# EasyEDA Pro project Enviroment（revision）.eprj

# Schematic Schematic1
Board Name: Board1; Create Date: 2025-10-28; Page Name: P1; Project Name: Enviroment（revision）; Schematic Name: Schematic1; Update Date: 2025-11-17; Company: EasyEDA.com; Page Size: A4; Version: V1.0
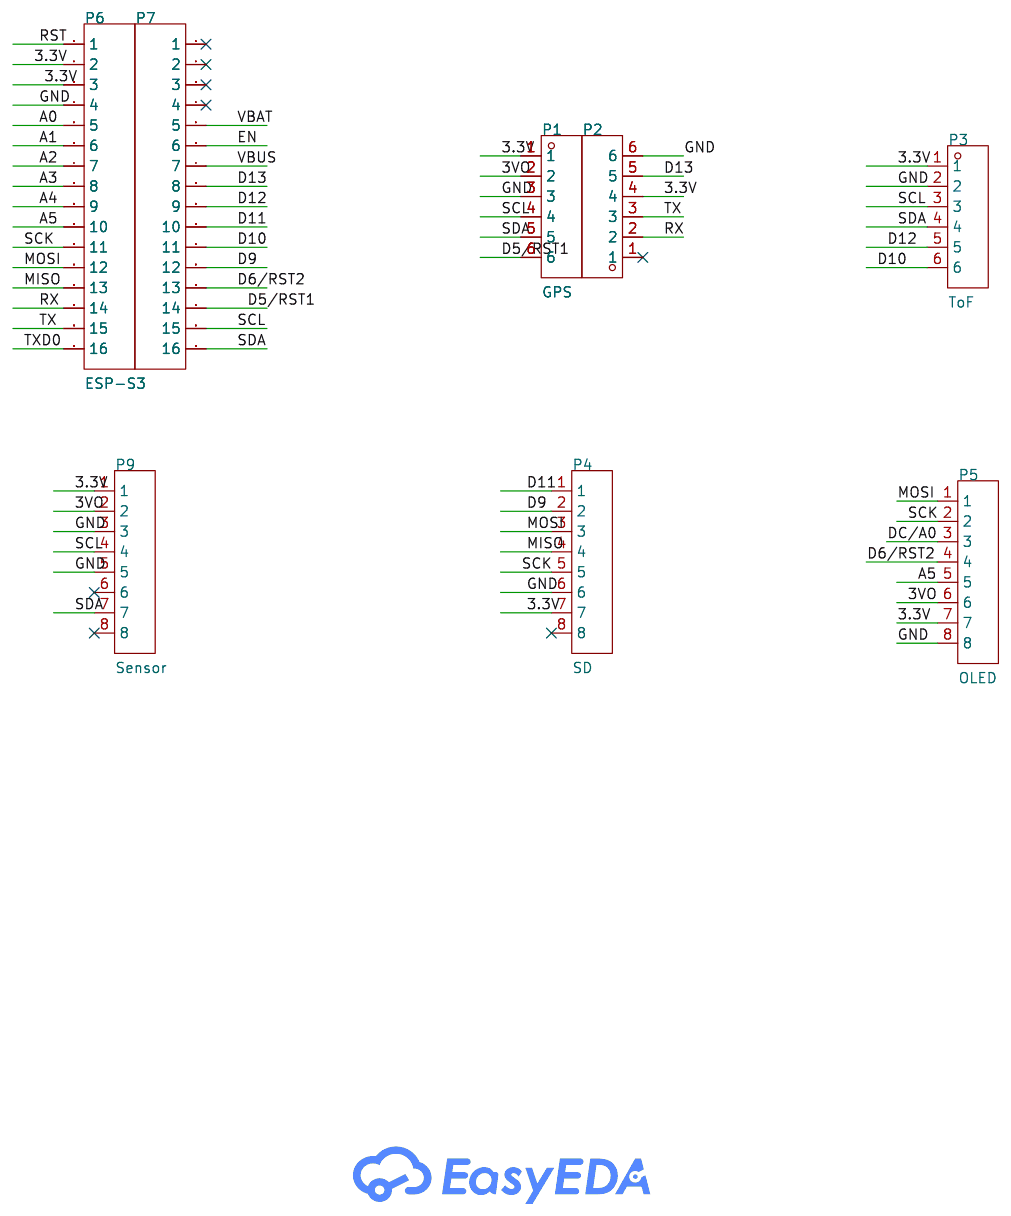
[diagram p0: schematic sheet]

## Parts
P1  GPS  [HDR-TH_6P-P2.54-V-F]
P2  2.54-1*6P母  [HDR-TH_6P-P2.54-V-F]
P3  ToF  [HDR-TH_6P-P2.54-V-F]
P4  SD  [HDR-TH_8P-P2.54-V-F_2]
P5  OLED  [HDR-TH_8P-P2.54-V-F_2]
P6  ESP-S3  [HDR-TH_16P-P2.54-V-F-1]
P7  2.54-1*16P母  [HDR-TH_16P-P2.54-V-F-1]
P9  Sensor  [HDR-TH_8P-P2.54-V-F_2]

## Library data of the parts
P1-P3 = 2.54-1*6P母: Holes Structure:1x6P Pitch:2.54mm Row Spacing:- Circular Hole / Square Hole:Square Hole Mounting Type:Through Hole Number of Rows:1 Number of Positions:6P Current Rating:3A Voltage Rating (Max):- Holes Direction:Top Insulation Height:- Contact Material:-; LCSC Part Name: 1x6P 间距:2.54mm 直插; Supplier Part: C40877; Manufacturer: BOOMELE(博穆精密); Supplier Footprint: 插件,P=2.54mm; JLCPCB Part Class: Extended Part; Datasheet: https://item.szlcsc.com/datasheet/2.54-1*6P%25E6%25AF%258D/41861.html; Supplier: LCSC; Holes Structure: 1x6P; Pitch: 2.54mm; Circular Hole / Square Hole: Square Hole; Mounting Type: Through Hole; Number of Rows: 1; Number of Positions: 6P; Current Rating: 3A; Holes Direction: Top; Operating Temperature: -40℃~+105℃
P4 P5 P9 = 2.54-1*8P母环保: Holes Structure:1x8P Pitch:2.54mm Row Spacing:- Circular Hole / Square Hole:Square Hole Mounting Type:Through Hole Number of Rows:1 Number of Positions:8P Holes Direction:Top Insulation Height:- Contact Material:- Contact Plating:-; LCSC Part Name: 1x8P 间距:2.54mm 直插; Supplier Part: C27438; Manufacturer: BOOMELE(博穆精密); Supplier Footprint: 插件,P=2.54mm; JLCPCB Part Class: 扩展库; Datasheet: https://item.szlcsc.com/datasheet/2.54-1*8P%25E6%25AF%258D%25E7%258E%25AF%25E4%25BF%259D/28187.html; Supplier: LCSC; Holes Structure: 1x8P; Pitch: 2.54mm; Circular Hole / Square Hole: Square Hole; Mounting Type: Through Hole; Number of Rows: 1; Number of Positions: 8P; Holes Direction: Top
P6 P7 = 2.54-1*16P母: Pitch:2.54mm Row Spacing:- Circular Hole / Square Hole:Square Hole Mounting Type:Through Hole Number of Rows:1 Number of Positions:16P Holes Direction:Top Insulation Height:- Contact Material:- Contact Plating:-; LCSC Part Name: 间距:2.54mm 直插; Supplier Part: C66987; Manufacturer: BOOMELE(博穆精密); Supplier Footprint: 插件,P=2.54mm; JLCPCB Part Class: 扩展库; Datasheet: https://item.szlcsc.com/datasheet/2.54-1*16P%25E6%25AF%258D/68075.html; Supplier: LCSC; Pitch: 2.54mm; Circular Hole / Square Hole: Square Hole; Mounting Type: Through Hole; Number of Rows: 1; Number of Positions: 16P; Holes Direction: Top

## Nets
3.3V: P1.1 P2.4 P3.1 P4.7 P5.7 P6.2 P6.3 P9.1
3VO: P1.2 P5.6 P9.2
GND: P1.3 P2.6 P3.2 P4.6 P5.8 P6.4 P9.3 P9.5
VBAT: P7.5
VBUS: P7.7
A0: P6.5
A1: P6.6
A2: P6.7
A3: P6.8
A4: P6.9
A5: P5.5 P6.10
D5/RST1: P1.6 P7.14
D6/RST2: P5.4 P7.13
D9: P4.2 P7.12
D10: P3.6 P7.11
D11: P4.1 P7.10
D12: P3.5 P7.9
D13: P2.5 P7.8
DC/A0: P5.3
EN: P7.6
MISO: P4.4 P6.13
MOSI: P4.3 P5.1 P6.12
RST: P6.1
RX: P2.2 P6.14
SCK: P4.5 P5.2 P6.11
SCL: P1.4 P3.3 P7.15 P9.4
SDA: P1.5 P3.4 P7.16 P9.7
TX: P2.3 P6.15
TXD0: P6.16

Not connected (* = marked no-connect by the designer): P2 1*; P4 8*; P7 1* 2* 3* 4*; P9 6* 8*

# Board PCB1
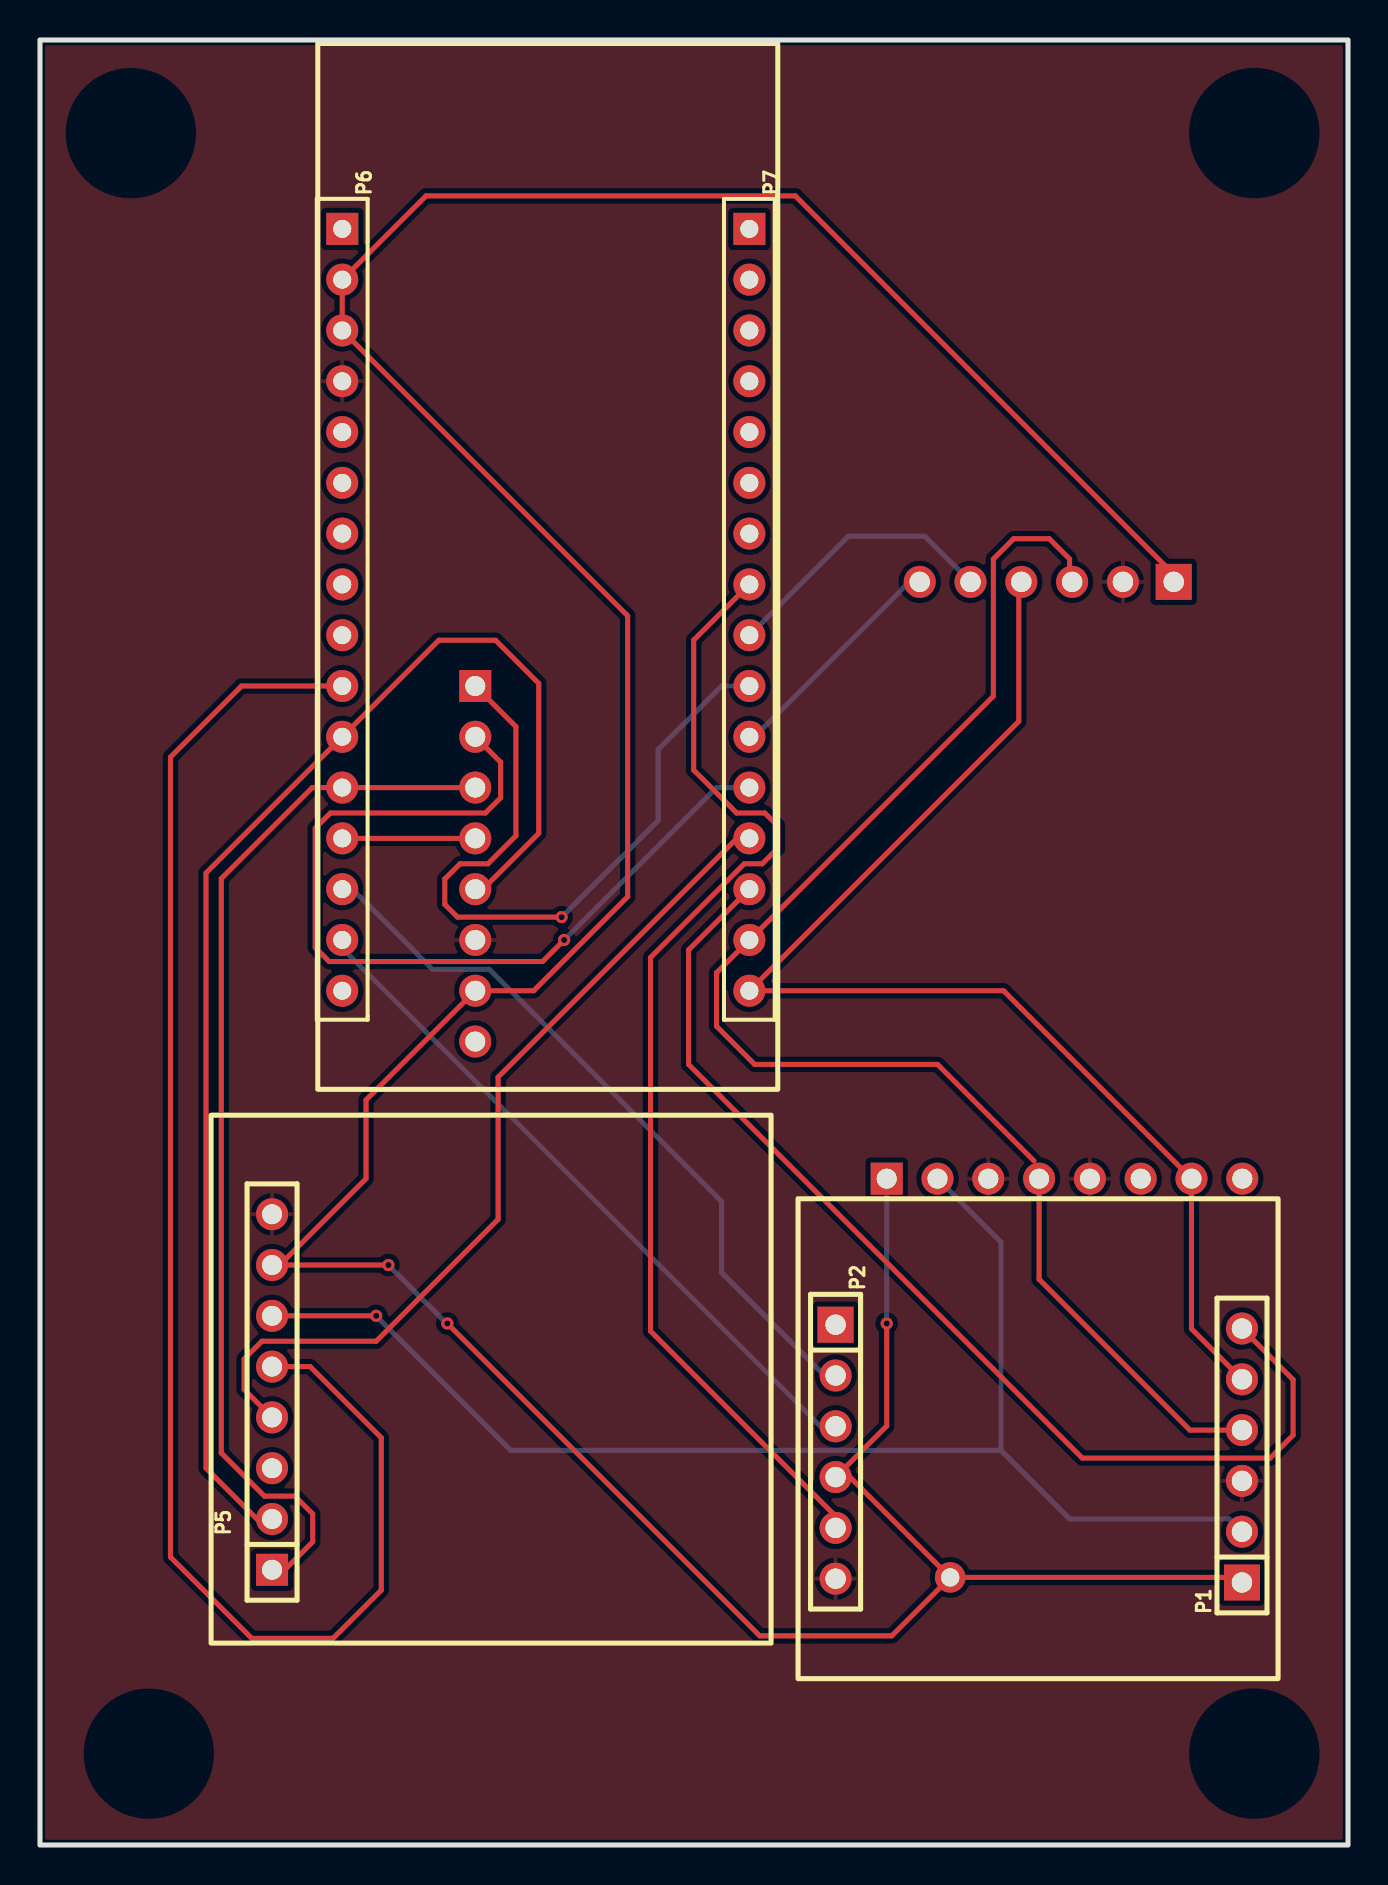
[diagram p1: board, top side]
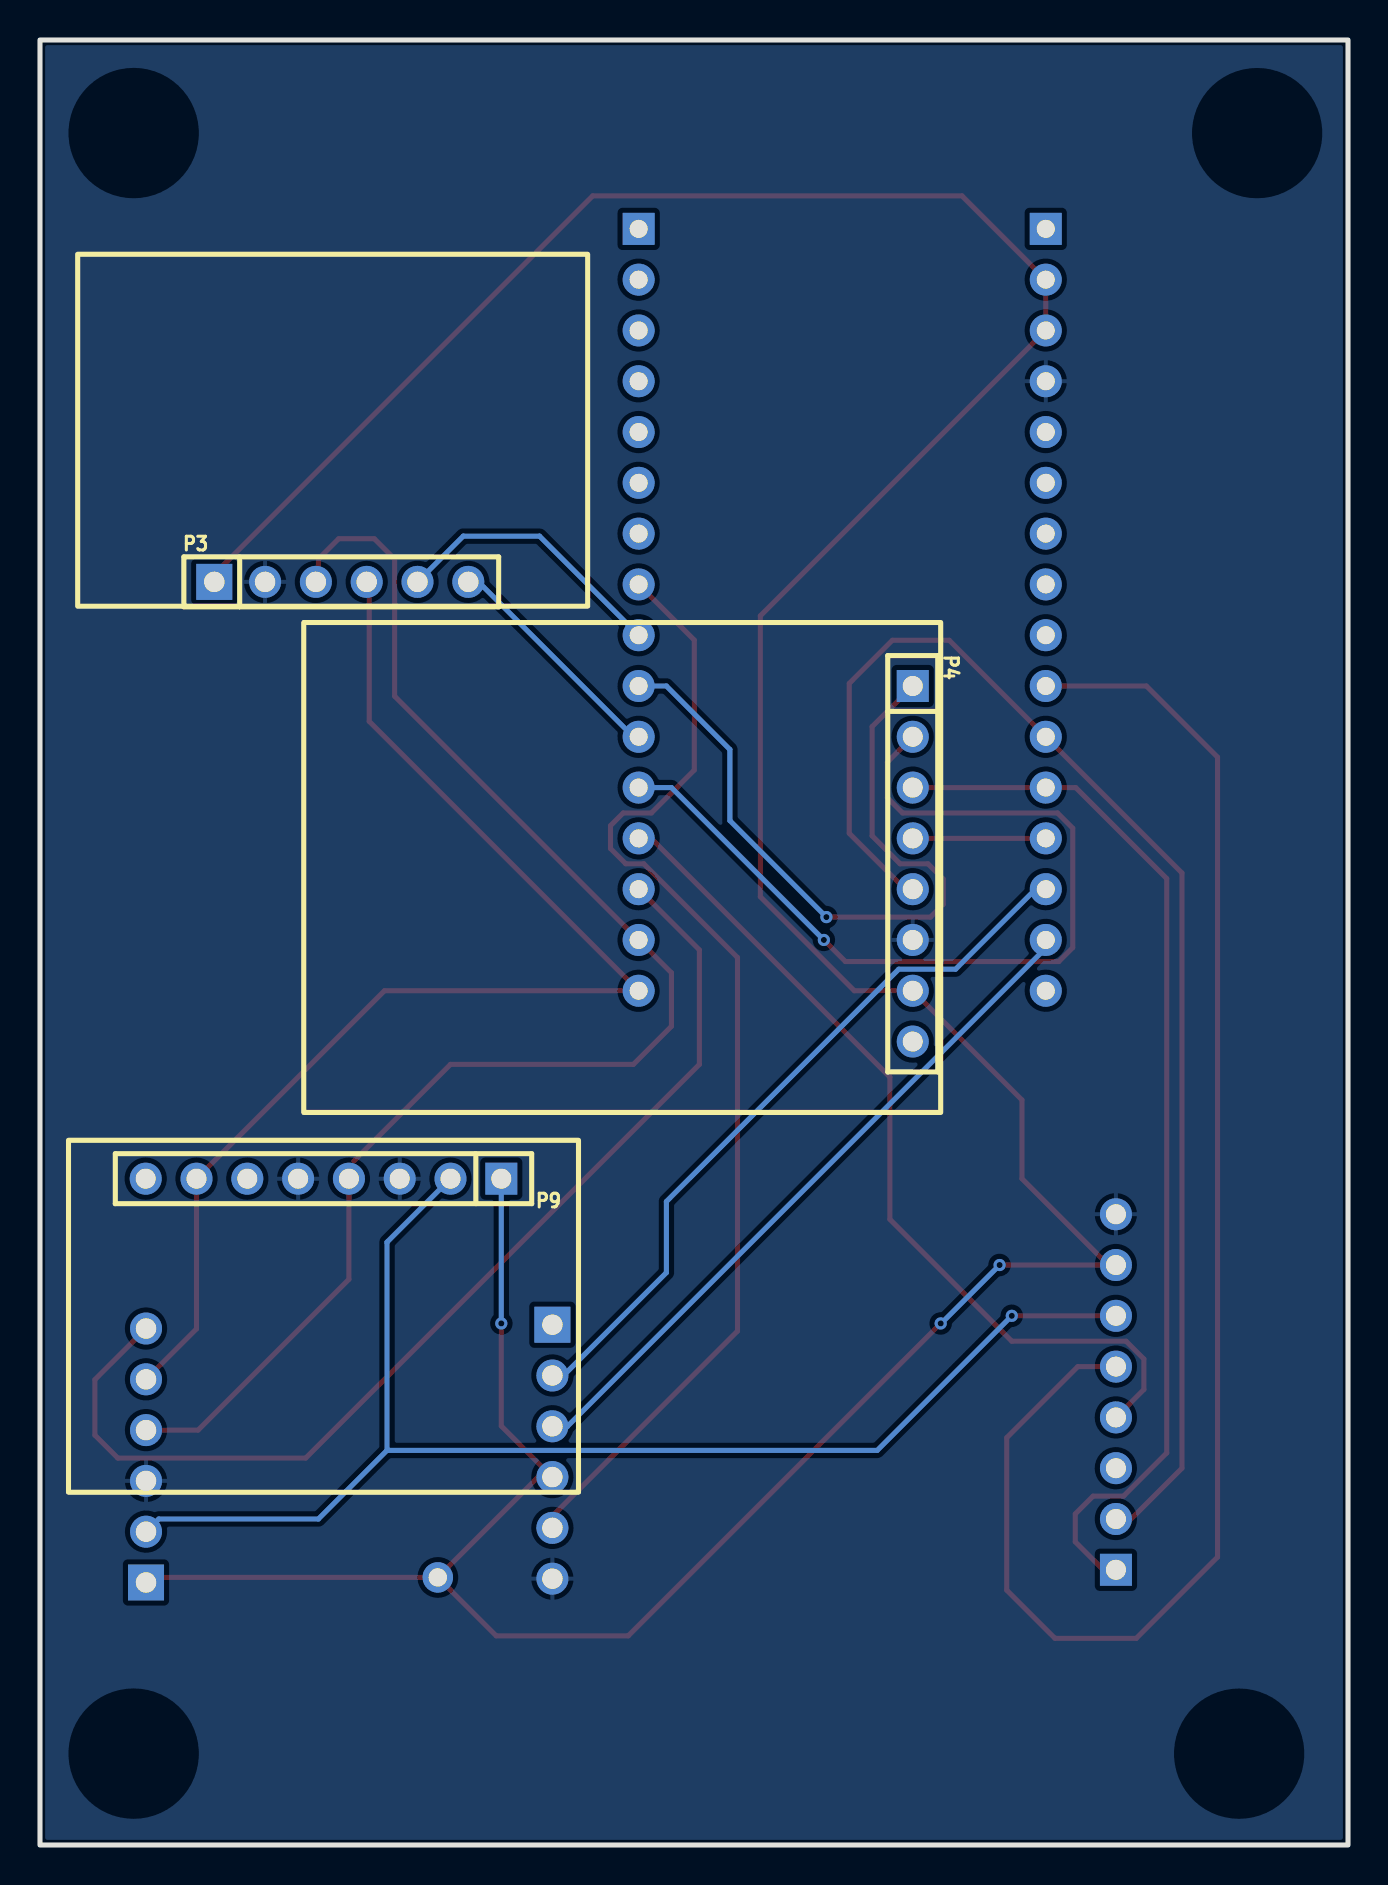
[diagram p2: board, bottom side, seen from below]

Outline 65.4 x 90.26 mm; copper layers: Top Layer, Inner1, Inner2, Bottom Layer. Coordinates in mm from the lower left corner of the outline.
Outline path: rectangle 0,90.26 65.4,0
Stack: Top Layer 0.035mm 外层铜厚1oz / Dielectric1 0.2104mm 7628 RC49% 8.6mil / Inner1 0.0152mm 内层铜厚 / Dielectric2 1.065mm 1.1mm H/HOZ Copper / Inner2 0.0152mm 内层铜厚 / Dielectric3 0.2104mm 7628 RC49% 8.6mil / Bottom Layer 0.035mm 外层铜厚1oz

## Design rules (mm)
template: JLCPCB Capability(Two Layers Board)
spacing copperThickness1oz (default): track to track 0.102, other pairs 0.152 to 0.3
spacing copperThickness2oz: track to track 0.203, other pairs 0.152 to 0.3
track width copperThickness1oz (default): min 0.127, default 0.254, max 2.54
track width copperThickness2oz: min 0.203, default 0.254, max 2.54
differential pair differentialPair (default): width min 0.127, default 0.254, max 2.54; gap min 0.152, default 0.152
via viaSize (default): diameter min 0.5, default 0.61, max 10; hole min 0.3, default 0.305, max 6.3

## Placement (name value [footprint] x y rotation side)
NOREF  -  [Pad_e327]  45.51 13.38 0 top
P1  GPS  [HDR-TH_6P-P2.54-V-F]  60.1 19.48 90 top
P2  2.54-1*6P母  [HDR-TH_6P-P2.54-V-F]  39.78 19.67 270 top
P3  ToF  [HDR-TH_6P-P2.54-V-F]  50.34 63.17 180 bottom
P4  SD  [HDR-TH_8P-P2.54-V-F_2]  21.76 49.07 270 bottom
P5  OLED  [HDR-TH_8P-P2.54-V-F_2]  11.6 22.65 90 top
P6  ESP-S3  [HDR-TH_16P-P2.54-V-F-1]  15.11 61.77 270 top
P7  2.54-1*16P母  [HDR-TH_16P-P2.54-V-F-1]  35.47 61.77 270 top
P9  Sensor  [HDR-TH_8P-P2.54-V-F_2]  51.23 33.32 0 bottom

## Footprints (pads in the part's own frame, mm; a bottom-side part is the same pattern mirrored in y, then rotated)
HDR-TH_6P-P2.54-V-F
  rect 1.8x1.8 hole 1.02: 1(-6.35,0)
  round 1.6 hole 1.02: 2(-3.81,0) 3(-1.27,0) 4(1.27,0) 5(3.81,0) 6(6.35,0)
HDR-TH_8P-P2.54-V-F_2
  rect 1.6x1.6 hole 1: 1(-8.89,0)
  round 1.6 hole 1: 2(-6.35,0) 3(-3.81,0) 4(-1.27,0) 5(1.27,0) 6(3.81,0) 7(6.35,0) 8(8.89,0)
HDR-TH_16P-P2.54-V-F-1
  rect 1.6x1.6 hole 0.9: 1(-19.05,0)
  round 1.6 hole 0.9: 2(-16.51,0) 3(-13.97,0) 4(-11.43,0) 5(-8.89,0) 6(-6.35,0) 7(-3.81,0) 8(-1.27,0) 9(1.27,0) 10(3.81,0) 11(6.35,0) 12(8.89,0) 13(11.43,0) 14(13.97,0) 15(16.51,0) 16(19.05,0)
Pad_e327
  round 1.524 hole 0.914: 1(0,0)

## Nets
As in the schematic, except:
3.3V: NOREF.1 P1.1 P2.4 P3.1 P4.7 P5.7 P6.2 P6.3 P9.1

Pads without a net: P2 1; P4 8; P7 1 2 3 4; P9 6 8

## Via types
v1: diameter 0.61, hole 0.305, Top Layer to Bottom Layer, 6 vias

## Routing (per net, layer and track width the routed paths; a pad name or vN(x,y) marks a point on that pad's centre or on a via; arc(x,y) is an arc through that point)
3.3V: length 195.4
  Top Layer w0.254: v1(42.34,26.08) 42.34,20.95 P2.4 40.5,18.4 NOREF.1 59.85,13.38 P1.1 ; 45.13,13 42.59,10.46 35.99,10.46 v1(20.37,26.08) ; 56.56,63.67 37.77,82.47 19.3,82.47 P6.2 P6.3 29.38,61.47 29.38,47.42 24.68,42.72 P4.7 16.3,37.26 16.3,33.32 11.98,29 v1(17.42,29)
  Bottom Layer w0.254: v1(42.34,26.08) P9.1 ; v1(17.42,29) 20.34,26.08 v1(20.37,26.08)
3VO: length 67.9
  Top Layer w0.254: P5.6 v1(16.81,26.46)
  Bottom Layer w0.254: 48.05,19.73 23.54,19.73 v1(16.81,26.46) ; 48.05,19.73 48.05,30.15 P9.2 ; 48.05,19.73 51.48,16.3 59.47,16.3 P1.2
A5: length 77.8
  Top Layer w0.254: P6.10 10.08,57.96 6.52,54.4 6.52,14.4 10.59,10.33 14.65,10.33 17.07,12.75 17.07,20.37 13.51,23.92 P5.5
D5/RST1: length 55.3
  Top Layer w0.254: P7.14 32.43,44.76 32.43,39.04 52.12,19.35 61.52,19.35 62.66,20.49 62.66,23.27 P1.6
D6/RST2: length 44.3
  Top Layer w0.254: P7.13 34.84,50.34 22.91,38.4 22.91,31.29 16.81,25.19 11.1,25.19 10.21,24.3 10.21,22.78 11.6,21.38 12.24,21.38
D9: length 45
  Top Layer w0.254: P4.2 23.03,54.15 23.03,52.37 22.27,51.61 14.52,51.61 13.76,50.85 13.76,44.88 14.46,44.18 25.13,44.18 v1(26.21,45.26)
  Bottom Layer w0.254: P7.12 33.83,52.88 v1(26.21,45.26)
D10: length 11.7
  Bottom Layer w0.254: P7.11 35.73,55.42 43.23,62.91 43.73,62.91 P3.6
D11: length 36.4
  Top Layer w0.254: P4.1 23.8,55.93 23.8,50.47 22.4,49.07 21,49.07 20.24,48.31 20.24,47.04 20.87,46.4 v1(26.08,46.4)
  Bottom Layer w0.254: v1(26.08,46.4) 30.91,51.23 30.91,54.78 34.08,57.96 P7.10
D12: length 14.1
  Bottom Layer w0.254: P7.9 40.42,65.45 44.24,65.45 P3.5
D13: length 57.9
  Top Layer w0.254: P7.8 32.69,60.25 32.69,53.75 34.83,51.61 36.24,51.61 36.88,50.97 36.88,49.83 36.11,49.07 35.21,49.07 30.53,44.38 30.53,25.7 39.78,16.45 P2.5
MISO: length 6.7
  Top Layer w0.254: P6.13 P4.4
MOSI: length 53.2
  Top Layer w0.254: 11.6,13.76 12.24,13.76 13.64,15.16 13.64,16.56 12.75,17.45 11.22,17.45 9.06,19.6 9.06,48.33 13.61,52.88 P6.12 P4.3
RX: length 36.8
  Bottom Layer w0.254: P2.2 39.23,23.48 34.08,28.62 34.08,32.18 22.46,43.8 19.62,43.8 15.62,47.8 P6.14
SCK: length 67.5
  Top Layer w0.254: 10.84,16.3 8.3,18.84 8.3,48.61 P6.11 19.94,60.25 22.78,60.25 24.94,58.09 24.94,50.59 22.14,47.8 P4.5
SCL: length 71.9
  Top Layer w0.254: 49.7,34.21 44.88,39.04 35.73,39.04 33.83,40.94 33.83,43.62 P7.15 35.48,45.26 47.67,57.45 47.67,64.31 48.69,65.33 50.47,65.33 51.48,64.31 51.48,63.29 P3.3 ; P9.4 49.96,28.29 57.5,20.75 P1.4
SDA: length 62.3
  Top Layer w0.254: P1.5 57.58,25.81 P9.7 48.18,42.72 P7.16 48.94,56.19 48.94,62.4
TX: length 35
  Bottom Layer w0.254: P6.15 15.11,44.85 39.03,20.94 P2.3

## Copper pours and planes (outline as drawn; the poured copper is in the pictures)
GND on Top Layer: -0.08,93.27 65.83,93.27 65.83,-8.46 -0.08,-8.46
GND on Bottom Layer: -3.64,94.28 67.61,94.28 67.61,-4.78 -3.64,-4.78
GND on Inner1: 0.26,90.01 65.15,90.01 65.15,0.26 0.26,0.26
GND on Inner2: 0.26,90.01 65.15,90.01 65.15,0.26 0.26,0.26

Small or netless copper shapes (teardrops, artwork), in the pictures only: 32 on Inner1, 32 on Inner2
